# Altium schematic sheet SubBus6.SchDoc
size A
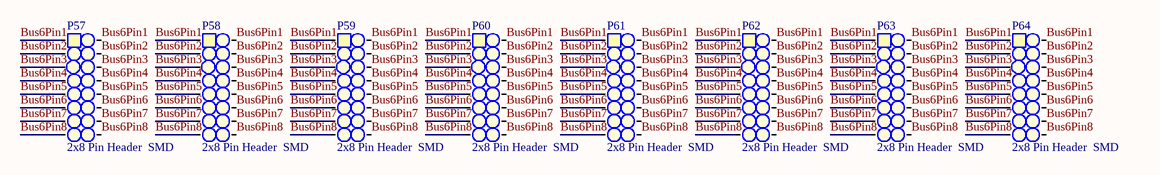
[diagram p0: SubBus6.SchDoc]

## Parts
P57  2x8 Pin Header  SMD  [2X8_SMD_PH_2.54]
P58  2x8 Pin Header  SMD  [2X8_SMD_PH_2.54]
P59  2x8 Pin Header  SMD  [2X8_SMD_PH_2.54]
P60  2x8 Pin Header  SMD  [2X8_SMD_PH_2.54]
P61  2x8 Pin Header  SMD  [2X8_SMD_PH_2.54]
P62  2x8 Pin Header  SMD  [2X8_SMD_PH_2.54]
P63  2x8 Pin Header  SMD  [2X8_SMD_PH_2.54]
P64  2x8 Pin Header  SMD  [2X8_SMD_PH_2.54]

## Nets
Bus6Pin1: P57.1 P57.16 P58.1 P58.16 P59.1 P59.16 P60.1 P60.16 P61.1 P61.16 P62.1 P62.16 P63.1 P63.16 P64.1 P64.16
Bus6Pin2: P57.2 P57.15 P58.2 P58.15 P59.2 P59.15 P60.2 P60.15 P61.2 P61.15 P62.2 P62.15 P63.2 P63.15 P64.2 P64.15
Bus6Pin3: P57.3 P57.14 P58.3 P58.14 P59.3 P59.14 P60.3 P60.14 P61.3 P61.14 P62.3 P62.14 P63.3 P63.14 P64.3 P64.14
Bus6Pin4: P57.4 P57.13 P58.4 P58.13 P59.4 P59.13 P60.4 P60.13 P61.4 P61.13 P62.4 P62.13 P63.4 P63.13 P64.4 P64.13
Bus6Pin5: P57.5 P57.12 P58.5 P58.12 P59.5 P59.12 P60.5 P60.12 P61.5 P61.12 P62.5 P62.12 P63.5 P63.12 P64.5 P64.12
Bus6Pin6: P57.6 P57.11 P58.6 P58.11 P59.6 P59.11 P60.6 P60.11 P61.6 P61.11 P62.6 P62.11 P63.6 P63.11 P64.6 P64.11
Bus6Pin7: P57.7 P57.10 P58.7 P58.10 P59.7 P59.10 P60.7 P60.10 P61.7 P61.10 P62.7 P62.10 P63.7 P63.10 P64.7 P64.10
Bus6Pin8: P57.8 P57.9 P58.8 P58.9 P59.8 P59.9 P60.8 P60.9 P61.8 P61.9 P62.8 P62.9 P63.8 P63.9 P64.8 P64.9

## Library data of the parts
P57-P64 = 2x8 Pin Header  SMD: 2.54mm, SMD; Value: 2x8 Pin Header, 2.54mm, SMD; Farnell: 2356242